# Altium project Internal_Thermostat_STM8_v1.0.PrjPcb
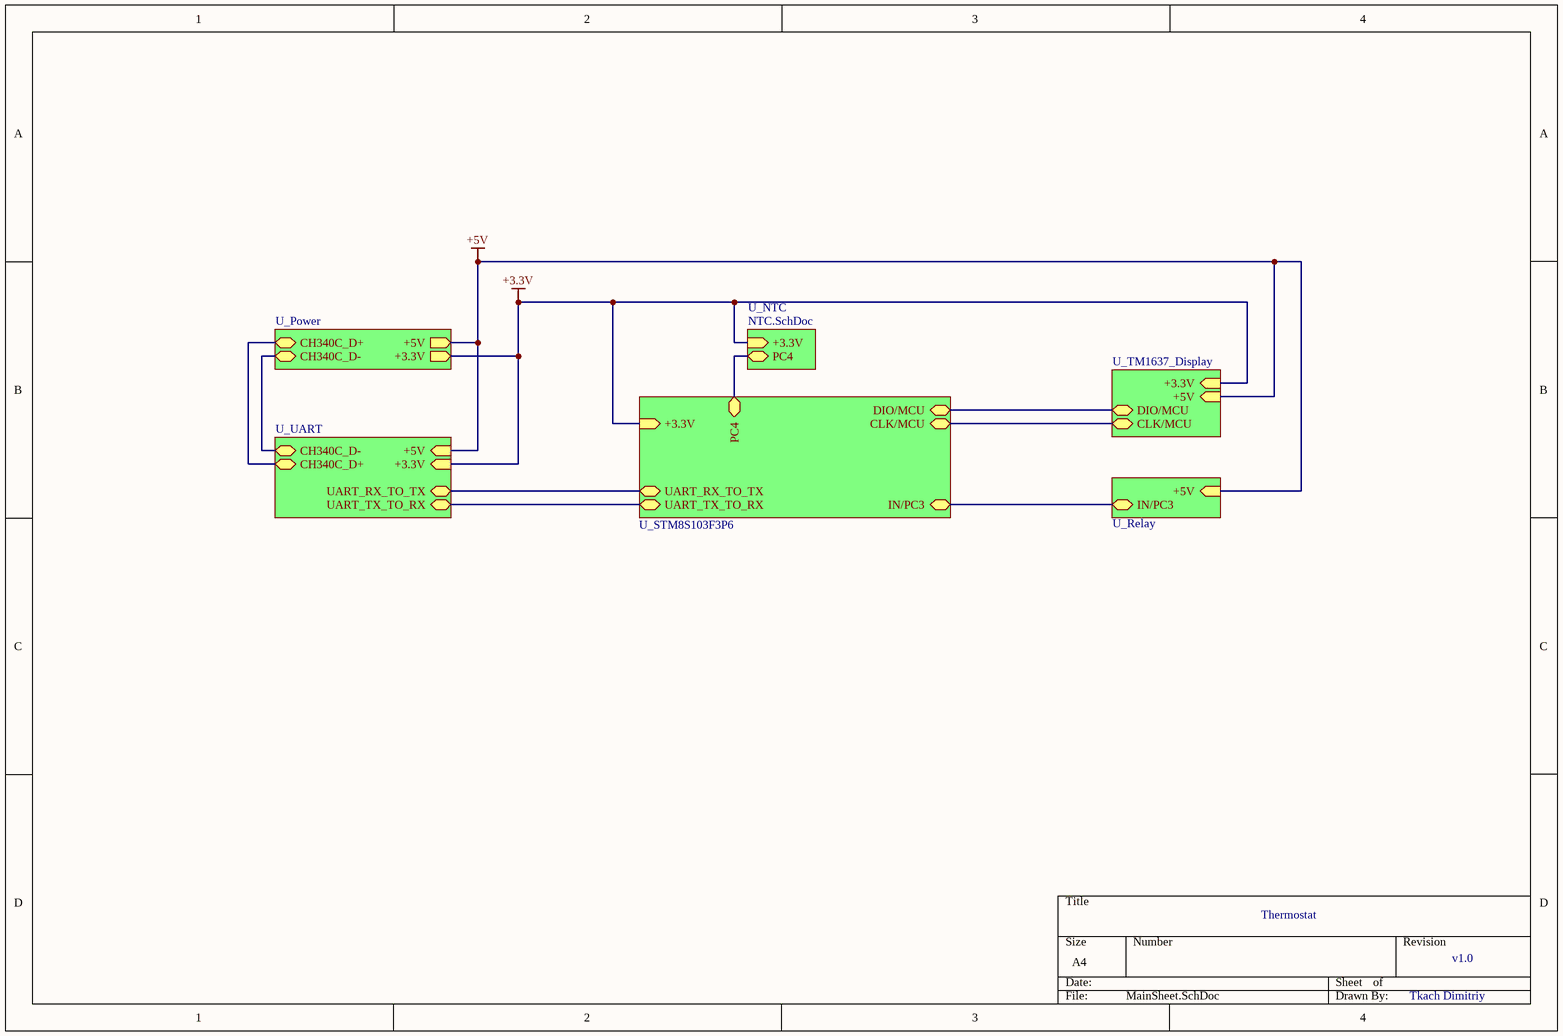
[diagram p0: MainSheet.SchDoc]
Copper_Weight: 35um; Layer_Count: 2; PCB_Material: FR-4; PCB_Name: Thermostat STM8 v1.0; PCB_Thickness: 1.6mm; SolderMask_Color: Green; Surface_Finish: HASL
7 sheets, 60 parts. Net scope: hierarchical (ports join the sheet entries above them; power ports are global).
Board file: Internal_PCB_Thermostat_STM8_v1.0.PcbDoc
Sheets:
  MainSheet.SchDoc
    U_Power = Power.SchDoc
    U_Relay = Relay.SchDoc
    U_TM1637_Display = TM1637_Display.SchDoc
    U_UART = UART.SchDoc
    U_STM8S103F3P6 = STM8S103F3P6.SchDoc
    U_NTC = NTC.SchDoc

## Sheet MainSheet.SchDoc
size A4; SheetNumber: 1; SheetTotal: 7

### Sub-sheets
U_NTC = NTC.SchDoc: PC4 (bidir), +3.3V (in)
U_Power = Power.SchDoc: CH340C_D+ (bidir), CH340C_D- (bidir), +5V (out), +3.3V (out)
U_Relay = Relay.SchDoc: IN/PC3 (bidir), +5V (in)
U_STM8S103F3P6 = STM8S103F3P6.SchDoc: +3.3V (in), IN/PC3 (bidir), DIO/MCU (bidir), CLK/MCU (bidir), UART_RX_TO_TX (bidir), UART_TX_TO_RX (bidir), PC4 (bidir)
U_TM1637_Display = TM1637_Display.SchDoc: +5V (in), +3.3V (in), DIO/MCU (bidir), CLK/MCU (bidir)
U_UART = UART.SchDoc: +5V (in), CH340C_D+ (bidir), CH340C_D- (bidir), UART_RX_TO_TX (bidir), +3.3V (in), UART_TX_TO_RX (bidir)

### Nets
+3.3V: sheet U_Power/+3.3V, sheet U_TM1637_Display/+3.3V, sheet U_UART/+3.3V, sheet U_STM8S103F3P6/+3.3V, sheet U_NTC/+3.3V
+5V: sheet U_Power/+5V, sheet U_Relay/+5V, sheet U_TM1637_Display/+5V, sheet U_UART/+5V
NetC10_2: sheet U_STM8S103F3P6/PC4, sheet U_NTC/PC4
NetQ1_2: sheet U_TM1637_Display/DIO/MCU, sheet U_STM8S103F3P6/DIO/MCU
NetQ2_2: sheet U_TM1637_Display/CLK/MCU, sheet U_STM8S103F3P6/CLK/MCU
NetQ3_2: sheet U_UART/UART_RX_TO_TX, sheet U_STM8S103F3P6/UART_RX_TO_TX
NetQ5_2: sheet U_UART/UART_TX_TO_RX, sheet U_STM8S103F3P6/UART_TX_TO_RX
NetR4_2: sheet U_Power/CH340C_D+, sheet U_UART/CH340C_D+
NetR9_2: sheet U_Power/CH340C_D-, sheet U_UART/CH340C_D-
NetR17_2: sheet U_Relay/IN/PC3, sheet U_STM8S103F3P6/IN/PC3

### Notes on the sheet
- Thermostat
- v1.0
- Tkach Dimitriy

## Sheet Power.SchDoc
size A4; SheetNumber: 5; SheetTotal: 7
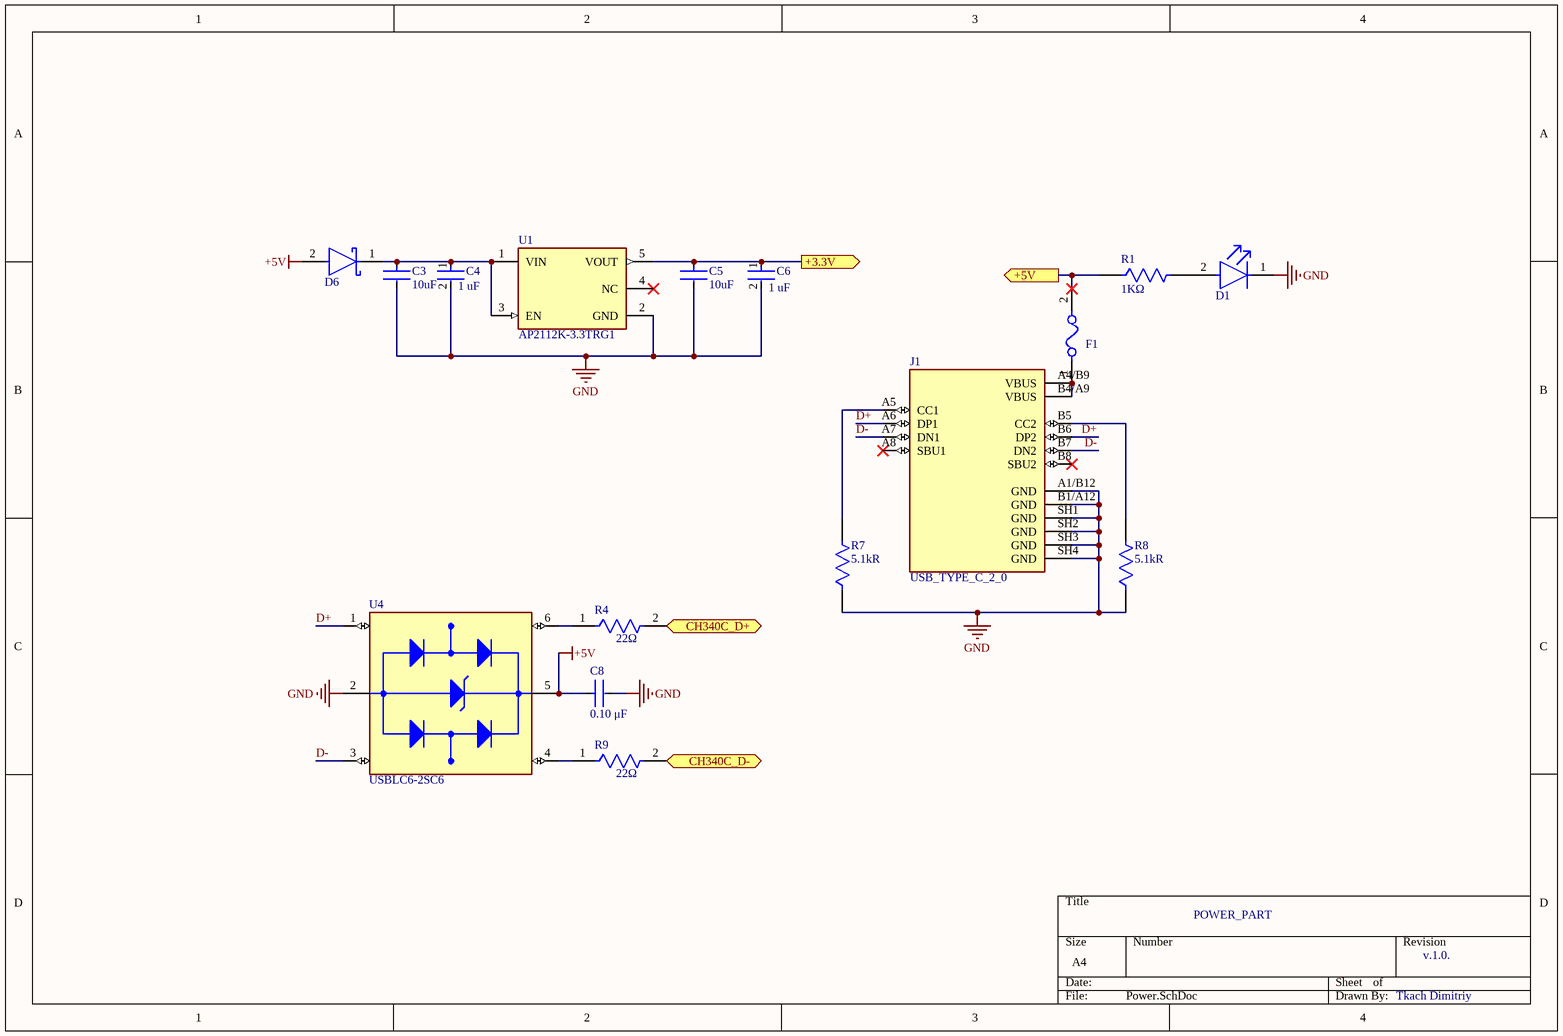
[diagram p1: Power.SchDoc]

### Parts
C3  Capacity: 10uF  [CAPC3216X18M]  (hidden comment: CGA5L1X7R1C106KT0Y0N)
C4  value 1 uF  [CAPC3216X18M]  (hidden comment: CC1206KFX7R7BB105)
C5  Capacity: 10uF  [CAPC3216X18M]  (hidden comment: CGA5L1X7R1C106KT0Y0N)
C6  value 1 uF  [CAPC3216X18M]  (hidden comment: CC1206KFX7R7BB105)
C8  Capacitance: 0.10 μF  [CAPC3216X18M]  (hidden comment: C1206C104K5RACAUTO)
D1  LTST-C150KRKT  [FP-LTST-C150KRKT-MFG]  (value not drawn)
D6  1N5819HW-7-F  [FP-SOD123-MFG]  (value not drawn)
F1  MF-NSMF050-2  [RESC3216X06M]  (value not drawn)
J1  USB_TYPE_C_2_0  [USB Type-C 16Pin]
R1  value 1KΩ  [RESC3216X06M]  (hidden comment: CRGCQ1206F1K0)
R4  Resistance: 22Ω  [RESC3216X06M]  (hidden comment: SR0603FR-7T22RL)
R7  Resistance: 5.1kR  [RESC3216X06M]  (hidden comment: ESR18EZPF5101)
R8  Resistance: 5.1kR  [RESC3216X06M]  (hidden comment: ESR18EZPF5101)
R9  Resistance: 22Ω  [RESC3216X06M]  (hidden comment: SR0603FR-7T22RL)
U1  AP2112K-3.3TRG1  [FP-SOT25-IPC_A]
U4  USBLC6-2SC6  [SOT95P280X145-6N]

### Ports
+3.3V (out, see MainSheet[2B], NTC[3B], STM8S103F3P6[3B], TM1637_Display[1B], UART[2B]), +5V (out, see MainSheet[2B], Relay[2B], TM1637_Display[3B], UART[3B]), CH340C_D+ (bidir, see MainSheet[1B], UART[3B]), CH340C_D- (bidir, see MainSheet[1B], UART[3B])

### Nets
+3.3V: C5.1 C6.1 U1.5(VOUT) ; port +3.3V
+5V: C8.1 D6.2(A) F1.2 R1.1 U4.5(VBUS) ; port +5V
GND: C3.2 C4.2 C5.2 C6.2 C8.2 D1.1(C) J1.A1/B12(GND) J1.B1/A12(GND) J1.SH1(GND) J1.SH2(GND) J1.SH3(GND) J1.SH4(GND) R7.1 R8.1 U1.2(GND) U4.2(GND)
D+: J1.A6(DP1) J1.B6(DP2) U4.1(I/O1_IN)
D-: J1.A7(DN1) J1.B7(DN2) U4.3(I/O2_IN)
NetC3_1: C3.1 C4.1 D6.1(C) U1.1(VIN) U1.3(EN)
NetD1_2: D1.2(A) R1.2
NetF1_1: F1.1 J1.A4/B9(VBUS) J1.B4/A9(VBUS)
NetJ1_A5: J1.A5(CC1) R7.2
NetJ1_B5: J1.B5(CC2) R8.2
NetR4_1: R4.1 U4.6(I/O1_OUT)
NetR4_2: R4.2 ; port CH340C_D+
NetR9_1: R9.1 U4.4(I/O2_OUT)
NetR9_2: R9.2 ; port CH340C_D-

Not connected (* = marked no-connect by the designer): J1 A8(SBU1)* B8(SBU2)*; U1 4(NC)*

### Notes on the sheet
- POWER_PART
- v.1.0.
- Tkach Dimitriy

### Library data of the parts
C3 C5 = CMP-08246-001386-1: Cap Ceramic 10uF 16V X7R 10% Pad SMD 1206 +125°C Automotive T/R
C4 C6 = CMP-03422-001151-1: CC1206 1 uF X7R 10.00%16 V; Manufacturer: Yageo; Voltage Rating: 16 V; Automotive Grade: NA; Temperature Coefficient: 15%; Material: Ceramic; Tolerance: 0.1; Category: Cap; Temperature: -55°C to +125°C; Temperature Range Low: -55°C; Capacitance: 1 uF; Package: CC1206-1.25; ComponentLink2Description: Datasheet; RoHS: TRUE; Footprint Url: http://www.yageo.com/exep/pages/download/literatures/UPY-C_GEN_24.pdf; Temperature Characteristic: X7R; ComponentLink2URL: http://www.yageo.com/documents/recent/UPY-NP0X7R_HV_1KV-to-3KV_11.pdf; Height: 1.45mm; Mouser Description: Multilayer Ceramic Capacitors MLCC - SMD/SMT 1.0uF 16V X7R 10%; Lead Free: Yes; Temperature Range High: +125°C; Device Class L1: Passive Components; Octopart: https://octopart.com/cc1206kfx7r7bb105-yageo-22250947; Automotive: No; Device Class L3: Ceramic Capacitors; Device Class L2: Capacitors; Manufacturer Part Number: CC1206KFX7R7BB105
C8 = CMP-03020-005759-1: CAP CER 0.1UF 50V X7R 1206; Manufacturer: KEMET; Temperature Coefficient: 15%; Value: 0.10 μF; Material: Ceramic; Automotive Grade: Grade 0; Tolerance: 0.1; RoHS: TRUE; Lead Free: Yes; ComponentLink2Description: Datasheet; Automotive: Yes; Temperature Characteristic: X7R; Temperature Range Low: -55°C; Voltage Rating: 50 V; Device Class L1: Passive Components; Ipc Land Pattern Name: CAPC320160X78; Mouser Description: Multilayer Ceramic Capacitors MLCC - SMD/SMT 0.1uF 50volts 10% X7R AUTO; Octopart: https://octopart.com/c1206c104k5racauto-kemet-12595586; Device Class L3: Ceramic Capacitors; Manufacturer Part Number: C1206C104K5RACAUTO; Digikey Description: CAP CER 0.1UF 50V X7R 1206; Temperature Range High: +150°C; Temperature: -55°C to +150°C; Device Class L2: Capacitors; ComponentLink2URL: https://content.kemet.com/datasheets/KEM_C1007_X8R_ULTRA_150C_SMD.pdf; Package: C1206C-EB; Category: Cap; Height: 0.88mm
D1 = 8706943c75ba83719d021d2fdc84c58: LED RED CLEAR 1206 SMD; Wavelength: 639nm; Power Dissipation: 62.5mW; Luminous Intensity: 54mcd; Test Current: 20mA; Forward Current: 30mA; Reverse Voltage: 5V; Viewing Angle: 130°; Number of Elements: 1; Lens Style: Diffused; Power Rating: 75mW; Lens Color: Colorless; Forward Voltage: 2V; Dominant Wavelength: 631nm; Depth: 1.6mm; Mount: Surface Mount; Packaging: Tape and Reel; Case Code (Metric): 3216; Lens Transparency: Clear; Illumination Color: Red; Radiation Hardening: No; Min Operating Temperature: -30°C; Height: 1.1mm; Case Code (Imperial): 1206; Number of Pins: 2; Length: 3.2mm; Lead Free: Lead Free; Color: Red; Width: 1.6mm; Number of LEDs: 1; Max Operating Temperature: 85°C; Case/Package: 1206; Package Quantity: 1
D6 = CMP-0303-00003-3: DIODE SCHOTTKY 40V 1A SOD123; Forward Voltage: 450mV; Capacitance: 110pF; Max Forward Surge Current (Ifsm): 25A; Peak Reverse Current: 50uA; Polarity: Standard; Element Configuration: Single; Max Power Dissipation: 450mW; Min Operating Temperature: -65°C; Package Quantity: 3000; Contact Plating: Tin; Weight: 0.000353oz; Max Repetitive Reverse Voltage (Vrrm): 40V; Max Reverse Voltage (DC): 40V; Height: 1.25mm; Average Rectified Current: 1A; Width: 1.7mm; Case/Package: SOD-123-2; Lead Free: Lead Free; Max Operating Temperature: 125°C; Current Rating: 1A; Termination: SMD/SMT; Forward Current: 1A; Radiation Hardening: No; Number of Pins: 2; Length: 2.85mm; Voltage Rating (DC): 40V; REACH SVHC: No SVHC; Peak Non-Repetitive Surge Current: 25A; Packaging: Tape and Reel; Output Current: 1A
F1 = CMP-07400-000036-1: PTC RESET FUSE 13.2V 500MA 1206; Manufacturer: Bourns; Resistance: 0.15-0.7Ω; Hold Current: 0.5A; Trip Current: 1A; Current Rating: 100A; Value: 0.15-0.7Ω; Automotive Grade: Grade 3; Trip Time: 0.1s; Temperature Range Low: -40°C; Temperature: -40°C to +85°C; Digikey Description: PTC RESET FUSE 13.2V 500MA 1206; Ambient Temperature Range Low: -40°C; RoHS: TRUE; Device Class L2: PTC Resettable Fuses; Octopart: https://octopart.com/mf-nsmf050-2-bourns-34532; ComponentLink2Description: Datasheet; Voltage Rating: 13.2V; Category: Fuse; ComponentLink2URL: https://www.bourns.com/docs/product-datasheets/mfnsmf.pdf?sfvrsn=39c76af6_14; Mouser Description: Resettable Fuses - PPTC 0.50A 13.2V 0.15ohm 1206 Footprint; Temperature Range High: +85°C; Device Class L1: Circuit Protection; Device Class L3: unset; Automotive: Yes; Package: MF-NSMF050-2; Ambient Temperature Range High: +85°C; Height: 0.85mm; Manufacturer Part Number: MF-NSMF050-2; Lead Free: Yes
J1 = USB_CMP-002-00072-1: USB-C (USB TYPE-C) USB 2.0 Receptacle Connector 24 (16+8 Dummy) Position Surface Mount, Right Angle; MP: USB4110GFA; MF: Global Connector Technology; Check_prices: https://www.snapeda.com/parts/USB4110GFA/Global+Connector+Technology/view-part/?ref=eda; Design Item ID: USB4110GFA; Source: USB4110GFA.SchLib; Pins: 16; Component Type: Connectors; SnapEDA_Link: https://www.snapeda.com/parts/USB4110GFA/Global+Connector+Technology/view-part/?ref=snap; Value: *; Case/Package: None
R1 = CMP-03211-006592-1: CRGCQ1206 1KΩ 0.25W 1% ±100ppm/°C 200V; Manufacturer: TE Connectivity; Automotive Grade: Grade 685; Tolerance: 0.01; Ipc Land Pattern Name: RESC310155X55; Temperature Range Low: -55°C; Device Class L3: Chip SMD Resistors; ComponentLink2URL: https://www.te.com/commerce/DocumentDelivery/DDEController?Action=showdoc&DocId=Data+Sheet%7F1773204-3%7F1%7Fpdf%7FEnglish%7FENG_DS_1773204-3_1.pdf%7F4-2176347-694; Automotive: Yes; Temperature: -55°C to +155°C; Manufacturer Part Number: CRGCQ1206F1K0; Package: CRGCQ1206; Octopart: https://octopart.com/crgcq1206f1k0-te+connectivity-91018258; Device Class L1: Passive Components; Series: CRGCQ; Device Class L2: Resistors; RoHS: TRUE; Lead Free: Yes; ComponentLink2Description: Datasheet; Power Rating: 0.25W; Temperature Coefficient: ±100ppm/°C; Voltage Rating: 200V; Temperature Range High: +155°C; Height: 0.65mm; Category: Res; Resistance: 1KΩ; Composition: Thick Film; Ambient Temperature Range High: +70°C
R4 R9 = CMP-03412-021889-1: RES 22 OHM 1% 1/4W 0603; Manufacturer: Yageo; Power Rating: 0.25W; Automotive Grade: Grade 0; Tolerance: 0.01; Voltage Rating: 75V; Value: 22Ω; Automotive: Yes; Manufacturer Part Number: SR0603FR-7T22RL; Device Class L1: Passive Components; Temperature Range Low: -55°C; Package: SR0603; Device Class L3: Chip SMD Resistors; Digikey Description: RES 22 OHM 1% 1/4W 0603; RoHS: TRUE; Device Class L2: Resistors; Height: 0.55mm; Ipc Land Pattern Name: RESC16080X45; Temperature Range High: +155°C; Temperature: -55°C to +155°C; Octopart: https://octopart.com/sr0603fr-7t22rl-yageo-91478080; Composition: Thick Film; Category: Res; ComponentLink2URL: http://www.yageo.com/documents/recent/PYu-SR_D_F%20tol_RoHS_L_3.pdf; Lead Free: Yes; Footprint Url: http://www.yageo.com/exep/pages/download/literatures/PYu-R_Mount_10.pdf; ComponentLink2Description: Datasheet; Series: SR
R7 R8 = CMP-08839-028234-1: 5.1kΩ ±1% 0.5W 1206 Anti-Surge Chip Resistor AEC-Q200; Temperature Coefficient: 100ppm/°C; Max Power Dissipation: 333mW; Resistor Type: Thick Film; Max Operating Temperature: 155°C; Min Operating Temperature: -55°C; Features: Automotive AEC-Q200; Height: 0.026inch; Length: 0.126inch; Packaging: Tape and Reel; Width: 0.063inch; Case/Package: 1206; Tolerance: 1%; Series: ESR18; Number of Terminations: 2; RoHS Compliant: Yes; Package Quantity: 5000
U1 = CMP-12756-000035-1: IC REG LINEAR 3.3V 600MA SOT25; Number of Regulators: 1; Output Type: Fixed; Polarity: Positive; Min Input Voltage: 2.5V; Max Input Voltage: 6V; Accuracy: 1.5%; Quiescent Current: 55uA; Dropout Voltage: 250mV; Min Operating Temperature: -40°C; Length: 3.1mm; Output Current: 600mA; Max Operating Temperature: 85°C; Package Quantity: 1; Output Voltage: 3.3V; Width: 1.7mm; Number of Outputs: 1; Packaging: Tape and Reel; Height: 1.3mm; Lead Free: Lead Free; Max Output Current: 600mA; Case/Package: SOT-23-5; Mount: Surface Mount; Number of Pins: 5
U4 = USBLC6-2SC6: 17V Clamp 5A (8/20Âµs) Ipp Tvs Diode Surface Mount SOT-23-6; MF: STMicroelectronics; Value: *; SnapEDA_Link: https://www.snapeda.com/parts/USBLC6-2SC6/STMicroelectronics/view-part/?ref=snap; Check_prices: https://www.snapeda.com/parts/USBLC6-2SC6/STMicroelectronics/view-part/?ref=eda; Purchase-URL: https://pricing.snapeda.com/search/part/USBLC6-2SC6/?ref=eda; Price: None; Availability: In Stock; Package: SOT-23-6 STMicroelectronics; MP: USBLC6-2SC6

## Sheet Relay.SchDoc
size A4; SheetNumber: 4; SheetTotal: 7
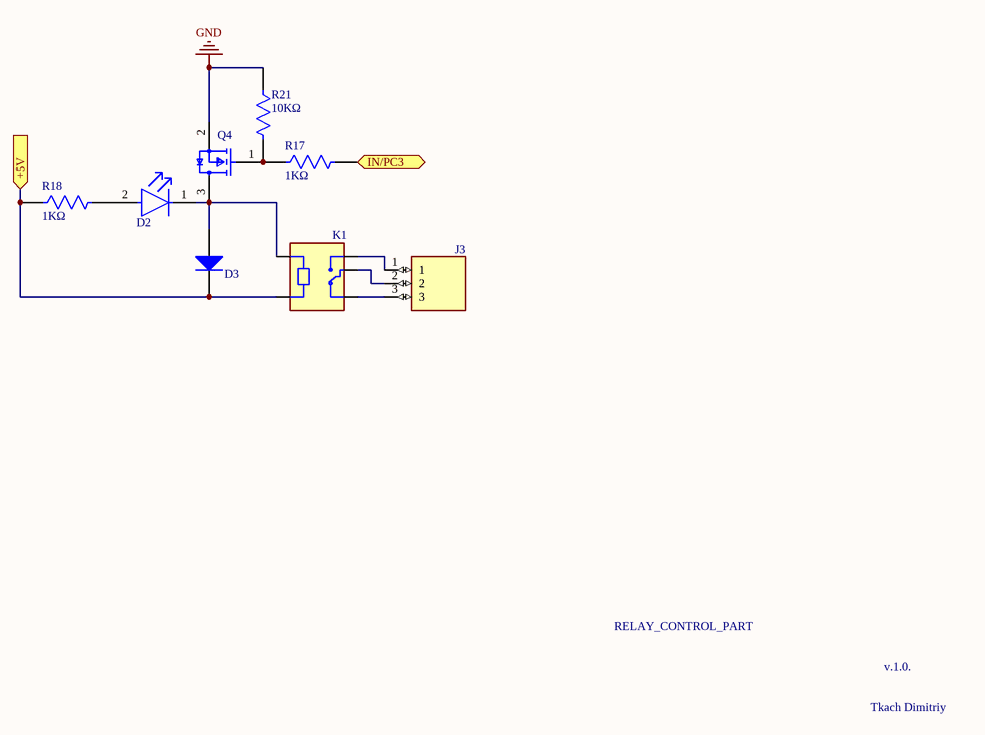
[diagram p2: Relay.SchDoc]

### Parts
D2  LTST-C150KRKT  [FP-LTST-C150KRKT-MFG]  (value not drawn)
D3  1N4148W-7-F  [DIOD-SOD123-2_V]  (value not drawn)
J3  39543-0603  [39543-0603]  (value not drawn)
K1  SRD-05VDC-SL-C  [RELAY_SRD-05VDC-SL-C]  (value not drawn)
Q4  2N7002-7-F  [FP-SOT23-MFG]  (value not drawn)
R17  value 1KΩ  [RESC3216X06M]  (hidden comment: CRGCQ1206F1K0)
R18  value 1KΩ  [RESC3216X06M]  (hidden comment: CRGCQ1206F1K0)
R21  Resistance: 10KΩ  [RESC3216X06M]  (hidden comment: CRGP1206F10K)

### Ports
+5V (in, see MainSheet[4B], Power[3B], TM1637_Display[3B], UART[3B]), IN/PC3 (bidir, see MainSheet[3B], STM8S103F3P6[2B])

### Nets
+5V: D3.2(K) K1.A2 R18.1 ; port +5V
GND: Q4.2(S) R21.1
NetD2_1: D2.1(C) D3.1(A) K1.A1 Q4.3(D)
NetD2_2: D2.2(A) R18.2
NetJ3_1: J3.1 K1.NO
NetJ3_2: J3.2 K1.COM
NetJ3_3: J3.3 K1.NC
NetQ4_1: Q4.1(G) R17.1 R21.2
NetR17_2: R17.2 ; port IN/PC3

### Notes on the sheet
- RELAY_CONTROL_PART
- v.1.0.
- Tkach Dimitriy

### Library data of the parts
D2 = 8706943c75ba83719d021d2fdc84c58: as D1 on sheet Power; Depth: 1.6mm; Mount: Surface Mount; Packaging: Tape and Reel; Case Code (Metric): 3216; Lens Transparency: Clear; Illumination Color: Red; Radiation Hardening: No; Min Operating Temperature: -30°C; Height: 1.1mm; Case Code (Imperial): 1206; Number of Pins: 2; Length: 3.2mm; Lead Free: Lead Free; Color: Red; Width: 1.6mm; Number of LEDs: 1; Max Operating Temperature: 85°C; Case/Package: 1206; Package Quantity: 1
D3 = CMP-2000-04932-2: Fast Switching Diode, 100 V, 0.15 A, -65 to 150 degC, 2-Pin?SOD123, RoHS, Tape and Reel; Recovery Time: 4ns; Brand: DiodesIncorporated; Unit Weight: 0.000353oz; Max Surge Current: 2A; Peak Reverse Voltage: 100V; Ir - Reverse Current: 1uA; Vf - Forward Voltage: 1.25V; Configuration: Single; If - Forward Current: 0.15A; Product Category: Diodes-GeneralPurpose,Power,Switching; Operating Temperature Range: -65Cto+150C; Packaging: Reel; Manufacturer URL: http://www.diodes.com/; Maximum Operating Temperature: +150C; Height: 1.25mm; Minimum Operating Temperature: -65C; Product: SwitchingDiodes; Package URL: http://www.diodes.com/datasheets/ds18004.pdf; Type: SwitchingDiode; Package Reference: SOD123-2; Width: 1.7mm; Datasheet URL: http://www.farnell.com/datasheets/1915529.pdf; Datasheet Version: Rev. 24-2, 10/2013; Series: 1N4148; Factory Pack Quantity: 3000; Length: 2.85mm; RoHS: True; Manufacturer: DiodesIncorporated; Mounting Style: SMD/SMT; Package / Case: SOD-123
J3 = CMP-037-000000-1: 3 Position Wire to Board Terminal Block Horizontal with Board 0.197 (5.00mm) Through Hole; MF: Molex; MP: 395430603; Component Type: Mechanicals; SnapEDA_Link: https://www.snapeda.com/parts/395430603/Molex/view-part/?ref=snap; Package: None; Check_prices: https://www.snapeda.com/parts/395430603/Molex/view-part/?ref=eda; Value: *; Source: 39543-0603.SchLib; Design Item ID: 39543-0603; Pin Count: 3
K1 = CMP-013-000000-1: 5V Trigger Relay Module For Arduino And Raspberry Pi 5V Trigger Relay Module For Arduino And Raspberry Pi; MF: Songle Relay; Source: SRD-05VDC-SL-C.SchLib; Check_prices: https://www.snapeda.com/parts/SRD-05VDC-SL-C/Songle+Relay/view-part/?ref=eda; Component Type: Standard; MP: SRD-05VDC-SL-C; SnapEDA_Link: https://www.snapeda.com/parts/SRD-05VDC-SL-C/Songle+Relay/view-part/?ref=snap; Price: None; Package: NON STANDARD-5 Songle Relay; Availability: Not in stock; Design Item ID: SRD-05VDC-SL-C; Value: *; Pin Count: 5
Q4 = 3b9c635fedb024a5347a57b145af9cc: MOSFET N-CH 60V 115MA SOT23-3; Turn-On Delay Time: 7ns; Turn-Off Delay Time: 11ns; Drain to Source Resistance: 7.5R; Rise Time: 3ns; Drain to Source Breakdown Voltage: 70V; Input Capacitance: 50pF; Number of Elements: 1; Power Dissipation: 540mW; Max Power Dissipation: 300mW; Fall Time: 5.6ns; Gate to Source Voltage (Vgs): 20V; Threshold Voltage: 2.5V; Element Configuration: Single; Termination: SMD/SMT; Weight: 0.000282oz; Radiation Hardening: No; Max Operating Temperature: 150°C; On-State Resistance: 7.5R; Mount: Surface Mount; Current Rating: 115mA; Contact Plating: Tin; Lead Free: Lead Free; Min Operating Temperature: -55°C; Number of Pins: 3; REACH SVHC: No SVHC; Drain to Source Voltage (Vdss): 60V; Width: 1.3mm; Package Quantity: 3000; Length: 2.9mm; Case/Package: SOT-23; Number of Channels: 1; Dual Supply Voltage: 60V; Packaging: Tape and Reel; Height: 1mm; Voltage Rating (DC): 60V; Nominal Vgs: 2.5V; Continuous Drain Current (ID): 115mA; Voltage: 60V; Rds On Max: 7.5R
R17 R18 = CMP-03211-006592-1: as R1 on sheet Power; Ipc Land Pattern Name: RESC310155X55; Temperature Range Low: -55°C; Device Class L3: Chip SMD Resistors; ComponentLink2URL: https://www.te.com/commerce/DocumentDelivery/DDEController?Action=showdoc&DocId=Data+Sheet%7F1773204-3%7F1%7Fpdf%7FEnglish%7FENG_DS_1773204-3_1.pdf%7F4-2176347-694; Automotive: Yes; Temperature: -55°C to +155°C; Manufacturer Part Number: CRGCQ1206F1K0; Package: CRGCQ1206; Octopart: https://octopart.com/crgcq1206f1k0-te+connectivity-91018258; Device Class L1: Passive Components; Series: CRGCQ; Device Class L2: Resistors; RoHS: TRUE; Lead Free: Yes; ComponentLink2Description: Datasheet; Power Rating: 0.25W; Temperature Coefficient: ±100ppm/°C; Voltage Rating: 200V; Temperature Range High: +155°C; Height: 0.65mm; Category: Res; Resistance: 1KΩ; Composition: Thick Film; Ambient Temperature Range High: +70°C
R21 = CMP-03211-004788-1: CRGP 1206 10K 1%; Manufacturer: TE; Temperature Coefficient: ±100ppm/°C; Value: 10KΩ; Tolerance: 0.01; Power Rating: 0.5W; Voltage Rating: 200V; Package: CRGP1206; Ambient Temperature Range High: +70°C; Device Class L2: Resistors; Lead Free: Yes; Automotive: No; Series: CRGP; Temperature Range High: +155°C; Ipc Land Pattern Name: RESC310155X55; Device Class L1: Passive Components; Octopart: https://octopart.com/crgp1206f10k-te+connectivity-91018843; Temperature: -55°C to +155°C; Category: Res; Height: 0.65mm; Temperature Range Low: -55°C; RoHS: TRUE; Manufacturer Part Number: CRGP1206F10K; Digikey Description: CRGP 1206 10K 1%; Device Class L3: Chip SMD Resistors; Composition: Thick Film; ComponentLink2URL: https://www.mouser.com/datasheet/2/418/NG_DS_9-1773463-9_A-1358566.pdf; ComponentLink2Description: Datasheet

## Sheet TM1637_Display.SchDoc
size A4; SheetNumber: 6; SheetTotal: 7
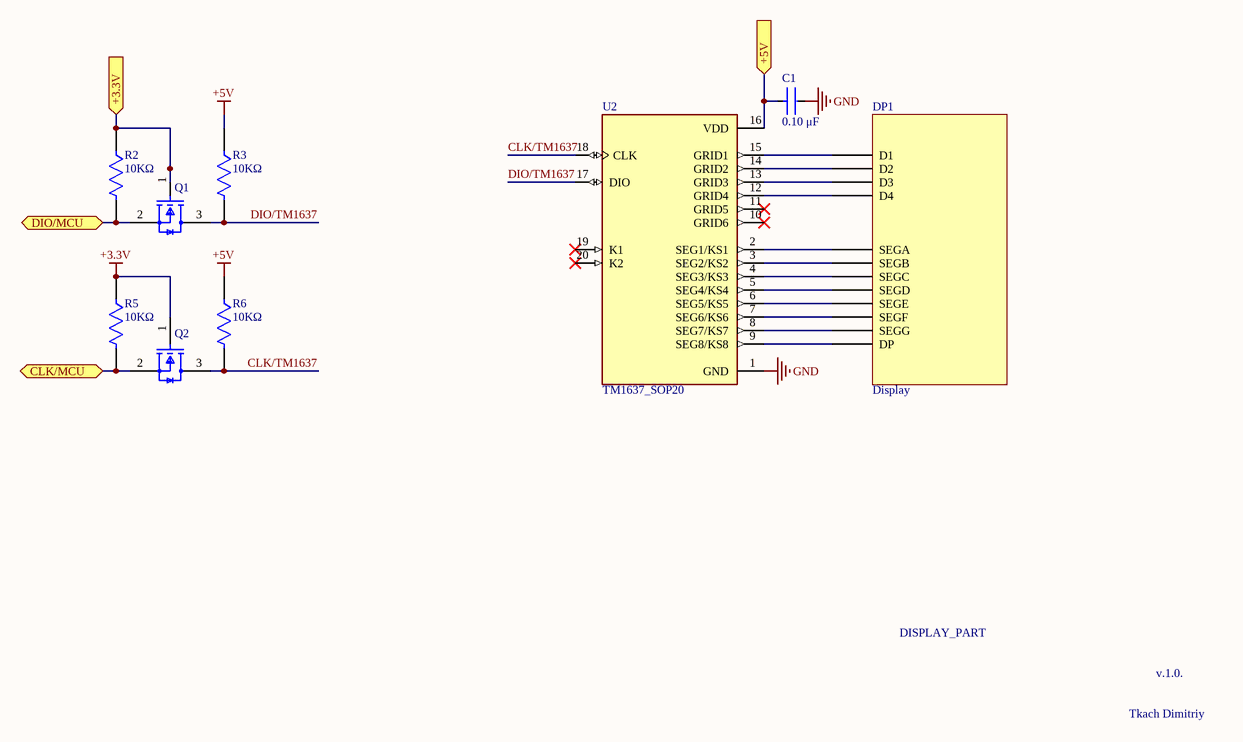
[diagram p3: TM1637_Display.SchDoc]

### Parts
C1  Capacitance: 0.10 μF  [CAPC3216X18M]  (hidden comment: C1206C104K5RACAUTO)
DP1  Display  [3461BS-1]
Q1  2N7002-7-F  [FP-SOT23-MFG]  (value not drawn)
Q2  2N7002-7-F  [FP-SOT23-MFG]  (value not drawn)
R2  Resistance: 10KΩ  [RESC3216X06M]  (hidden comment: CRGP1206F10K)
R3  Resistance: 10KΩ  [RESC3216X06M]  (hidden comment: CRGP1206F10K)
R5  Resistance: 10KΩ  [RESC3216X06M]  (hidden comment: CRGP1206F10K)
R6  Resistance: 10KΩ  [RESC3216X06M]  (hidden comment: CRGP1206F10K)
U2  TM1637_SOP20  [SOIC127P1035X255-20N]

### Ports
+3.3V (in, see MainSheet[4B], NTC[3B], Power[3B], STM8S103F3P6[3B], UART[2B]), +5V (in, see MainSheet[4B], Power[3B], Relay[2B], UART[3B]), CLK/MCU (bidir, see MainSheet[3B], STM8S103F3P6[2B]), DIO/MCU (bidir, see MainSheet[3B], STM8S103F3P6[2B])

### Nets
+3.3V: Q1.1(G) Q2.1(G) R2.1 R5.1 ; port +3.3V
+5V: C1.1 R3.1 R6.1 U2.16(VDD) ; port +5V
GND: C1.2 U2.1(GND)
CLK/TM1637: Q2.3(D) R6.2 U2.18(CLK)
DIO/TM1637: Q1.3(D) R3.2 U2.17(DIO)
NetDP1_D1: DP1.D1 U2.15(GRID1)
NetDP1_D2: DP1.D2 U2.14(GRID2)
NetDP1_D3: DP1.D3 U2.13(GRID3)
NetDP1_D4: DP1.D4 U2.12(GRID4)
NetDP1_DP: DP1.DP U2.9(SEG8/KS8)
NetDP1_SEGA: DP1.SEGA U2.2(SEG1/KS1)
NetDP1_SEGB: DP1.SEGB U2.3(SEG2/KS2)
NetDP1_SEGC: DP1.SEGC U2.4(SEG3/KS3)
NetDP1_SEGD: DP1.SEGD U2.5(SEG4/KS4)
NetDP1_SEGE: DP1.SEGE U2.6(SEG5/KS5)
NetDP1_SEGF: DP1.SEGF U2.7(SEG6/KS6)
NetDP1_SEGG: DP1.SEGG U2.8(SEG7/KS7)
NetQ1_2: Q1.2(S) R2.2 ; port DIO/MCU
NetQ2_2: Q2.2(S) R5.2 ; port CLK/MCU

Not connected (* = marked no-connect by the designer): U2 10(GRID6)* 11(GRID5)* 19(K1)* 20(K2)*

### Notes on the sheet
- DISPLAY_PART
- v.1.0.
- Tkach Dimitriy

### Library data of the parts
C1 = CMP-03020-005759-1: as C8 on sheet Power; RoHS: TRUE; Lead Free: Yes; ComponentLink2Description: Datasheet; Automotive: Yes; Temperature Characteristic: X7R; Temperature Range Low: -55°C; Voltage Rating: 50 V; Device Class L1: Passive Components; Ipc Land Pattern Name: CAPC320160X78; Mouser Description: Multilayer Ceramic Capacitors MLCC - SMD/SMT 0.1uF 50volts 10% X7R AUTO; Octopart: https://octopart.com/c1206c104k5racauto-kemet-12595586; Device Class L3: Ceramic Capacitors; Manufacturer Part Number: C1206C104K5RACAUTO; Digikey Description: CAP CER 0.1UF 50V X7R 1206; Temperature Range High: +150°C; Temperature: -55°C to +150°C; Device Class L2: Capacitors; ComponentLink2URL: https://content.kemet.com/datasheets/KEM_C1007_X8R_ULTRA_150C_SMD.pdf; Package: C1206C-EB; Category: Cap; Height: 0.88mm
DP1 = Component_1_1
Q1 Q2 = 3b9c635fedb024a5347a57b145af9cc: as Q4 on sheet Relay; Termination: SMD/SMT; Weight: 0.000282oz; Radiation Hardening: No; Max Operating Temperature: 150°C; On-State Resistance: 7.5R; Mount: Surface Mount; Current Rating: 115mA; Contact Plating: Tin; Lead Free: Lead Free; Min Operating Temperature: -55°C; Number of Pins: 3; REACH SVHC: No SVHC; Drain to Source Voltage (Vdss): 60V; Width: 1.3mm; Package Quantity: 3000; Length: 2.9mm; Case/Package: SOT-23; Number of Channels: 1; Dual Supply Voltage: 60V; Packaging: Tape and Reel; Height: 1mm; Voltage Rating (DC): 60V; Nominal Vgs: 2.5V; Continuous Drain Current (ID): 115mA; Voltage: 60V; Rds On Max: 7.5R
R2 R3 R5 R6 = CMP-03211-004788-1: as R21 on sheet Relay; Package: CRGP1206; Ambient Temperature Range High: +70°C; Device Class L2: Resistors; Lead Free: Yes; Automotive: No; Series: CRGP; Temperature Range High: +155°C; Ipc Land Pattern Name: RESC310155X55; Device Class L1: Passive Components; Octopart: https://octopart.com/crgp1206f10k-te+connectivity-91018843; Temperature: -55°C to +155°C; Category: Res; Height: 0.65mm; Temperature Range Low: -55°C; RoHS: TRUE; Manufacturer Part Number: CRGP1206F10K; Digikey Description: CRGP 1206 10K 1%; Device Class L3: Chip SMD Resistors; Composition: Thick Film; ComponentLink2URL: https://www.mouser.com/datasheet/2/418/NG_DS_9-1773463-9_A-1358566.pdf; ComponentLink2Description: Datasheet
U2 = TM1637_SOP20: LED Drive Control Special Circuit; MF: Titan Micro Electronics; SnapEDA_Link: https://www.snapeda.com/parts/TM1637_SOP20/Titan+Micro+Electronics/view-part/?ref=snap; Package: Package; Value: *; MP: TM1637_SOP20; Check_prices: https://www.snapeda.com/parts/TM1637_SOP20/Titan+Micro+Electronics/view-part/?ref=eda

## Sheet UART.SchDoc
size A4; SheetNumber: 3; SheetTotal: 7
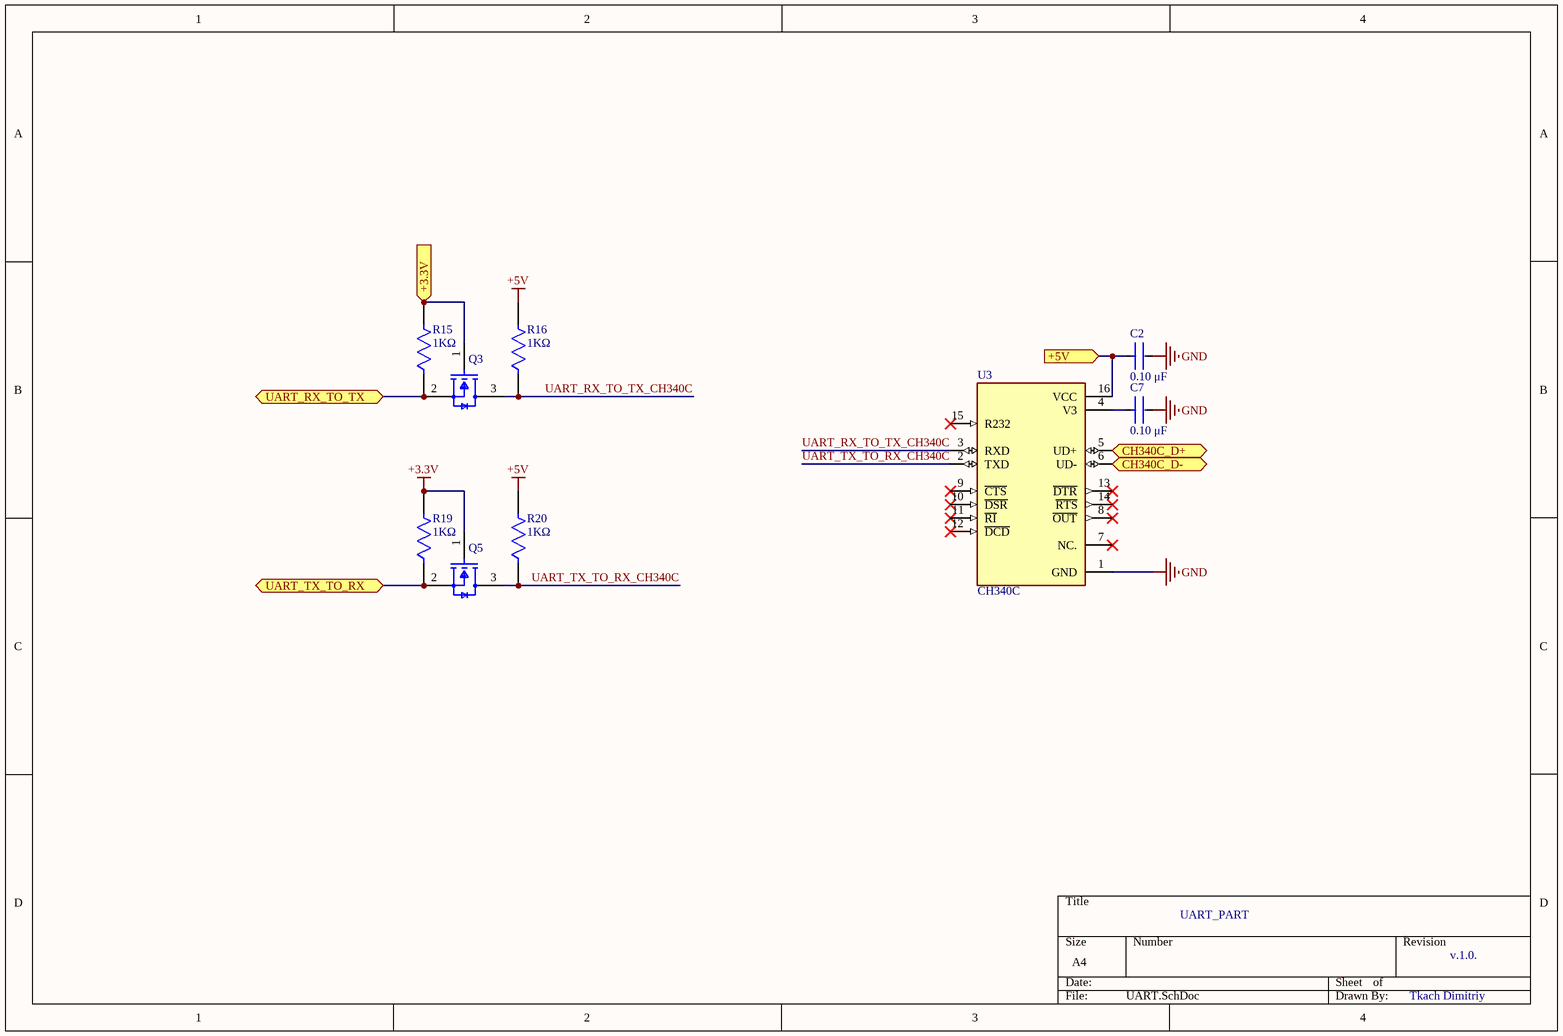
[diagram p4: UART.SchDoc]

### Parts
C2  Capacitance: 0.10 μF  [CAPC3216X18M]  (hidden comment: C1206C104K5RACAUTO)
C7  Capacitance: 0.10 μF  [CAPC3216X18M]  (hidden comment: C1206C104K5RACAUTO)
Q3  2N7002-7-F  [FP-SOT23-MFG]  (value not drawn)
Q5  2N7002-7-F  [FP-SOT23-MFG]  (value not drawn)
R15  value 1KΩ  [RESC3216X06M]  (hidden comment: CRGCQ1206F1K0)
R16  value 1KΩ  [RESC3216X06M]  (hidden comment: CRGCQ1206F1K0)
R19  value 1KΩ  [RESC3216X06M]  (hidden comment: CRGCQ1206F1K0)
R20  value 1KΩ  [RESC3216X06M]  (hidden comment: CRGCQ1206F1K0)
U3  CH340C  [SOIC127P600X180-16N]

### Ports
+3.3V (in, see MainSheet[2B], NTC[3B], Power[3B], STM8S103F3P6[3B], TM1637_Display[1B]), +5V (in, see MainSheet[2B], Power[3B], Relay[2B], TM1637_Display[3B]), CH340C_D+ (bidir, see MainSheet[1B], Power[2C]), CH340C_D- (bidir, see MainSheet[1B], Power[2C]), UART_RX_TO_TX (bidir, see MainSheet[2B], STM8S103F3P6[2C]), UART_TX_TO_RX (bidir, see MainSheet[2B], STM8S103F3P6[2C])

### Nets
+3.3V: Q3.1(G) Q5.1(G) R15.2 R19.2 ; port +3.3V
+5V: C2.1 R16.2 R20.2 U3.16(VCC) ; port +5V
GND: C2.2 C7.2 U3.1(GND)
UART_RX_TO_TX_CH340C: Q3.3(D) R16.1 U3.3(RXD)
UART_TX_TO_RX_CH340C: Q5.3(D) R20.1 U3.2(TXD)
NetC7_1: C7.1 U3.4(V3)
NetQ3_2: Q3.2(S) R15.1 ; port UART_RX_TO_TX
NetQ5_2: Q5.2(S) R19.1 ; port UART_TX_TO_RX
NetR4_2: U3.5(UD+) ; port CH340C_D+
NetR9_2: U3.6(UD-) ; port CH340C_D-

Not connected (* = marked no-connect by the designer): U3 7(NC.)* 8(~{OUT})* 9(~{CTS})* 10(~{DSR})* 11(~{RI})* 12(~{DCD})* 13(~{DTR})* 14(~{RTS})* 15(R232)*

### Notes on the sheet
- UART_PART
- v.1.0.
- Tkach Dimitriy

### Library data of the parts
C2 C7 = CMP-03020-005759-1: as C8 on sheet Power; RoHS: TRUE; Lead Free: Yes; ComponentLink2Description: Datasheet; Automotive: Yes; Temperature Characteristic: X7R; Temperature Range Low: -55°C; Voltage Rating: 50 V; Device Class L1: Passive Components; Ipc Land Pattern Name: CAPC320160X78; Mouser Description: Multilayer Ceramic Capacitors MLCC - SMD/SMT 0.1uF 50volts 10% X7R AUTO; Octopart: https://octopart.com/c1206c104k5racauto-kemet-12595586; Device Class L3: Ceramic Capacitors; Manufacturer Part Number: C1206C104K5RACAUTO; Digikey Description: CAP CER 0.1UF 50V X7R 1206; Temperature Range High: +150°C; Temperature: -55°C to +150°C; Device Class L2: Capacitors; ComponentLink2URL: https://content.kemet.com/datasheets/KEM_C1007_X8R_ULTRA_150C_SMD.pdf; Package: C1206C-EB; Category: Cap; Height: 0.88mm
Q3 Q5 = 3b9c635fedb024a5347a57b145af9cc: as Q4 on sheet Relay; Termination: SMD/SMT; Weight: 0.000282oz; Radiation Hardening: No; Max Operating Temperature: 150°C; On-State Resistance: 7.5R; Mount: Surface Mount; Current Rating: 115mA; Contact Plating: Tin; Lead Free: Lead Free; Min Operating Temperature: -55°C; Number of Pins: 3; REACH SVHC: No SVHC; Drain to Source Voltage (Vdss): 60V; Width: 1.3mm; Package Quantity: 3000; Length: 2.9mm; Case/Package: SOT-23; Number of Channels: 1; Dual Supply Voltage: 60V; Packaging: Tape and Reel; Height: 1mm; Voltage Rating (DC): 60V; Nominal Vgs: 2.5V; Continuous Drain Current (ID): 115mA; Voltage: 60V; Rds On Max: 7.5R
R15 R16 R19 R20 = CMP-03211-006592-1: as R1 on sheet Power; Ipc Land Pattern Name: RESC310155X55; Temperature Range Low: -55°C; Device Class L3: Chip SMD Resistors; ComponentLink2URL: https://www.te.com/commerce/DocumentDelivery/DDEController?Action=showdoc&DocId=Data+Sheet%7F1773204-3%7F1%7Fpdf%7FEnglish%7FENG_DS_1773204-3_1.pdf%7F4-2176347-694; Automotive: Yes; Temperature: -55°C to +155°C; Manufacturer Part Number: CRGCQ1206F1K0; Package: CRGCQ1206; Octopart: https://octopart.com/crgcq1206f1k0-te+connectivity-91018258; Device Class L1: Passive Components; Series: CRGCQ; Device Class L2: Resistors; RoHS: TRUE; Lead Free: Yes; ComponentLink2Description: Datasheet; Power Rating: 0.25W; Temperature Coefficient: ±100ppm/°C; Voltage Rating: 200V; Temperature Range High: +155°C; Height: 0.65mm; Category: Res; Resistance: 1KΩ; Composition: Thick Film; Ambient Temperature Range High: +70°C
U3 = CMP-019-000000-1: USB to serial chip CH340; MF: WCH; Component Type: Standard; Design Item ID: CH340C; Availability: Not in stock; MP: CH340C; Value: *; Source: CH340C.SchLib; SnapEDA_Link: https://www.snapeda.com/parts/CH340C/WCH/view-part/?ref=snap; Package: None; Pin Count: 16; Check_prices: https://www.snapeda.com/parts/CH340C/WCH/view-part/?ref=eda; Price: None

## Sheet STM8S103F3P6.SchDoc
size A4; SheetNumber: 2; SheetTotal: 7
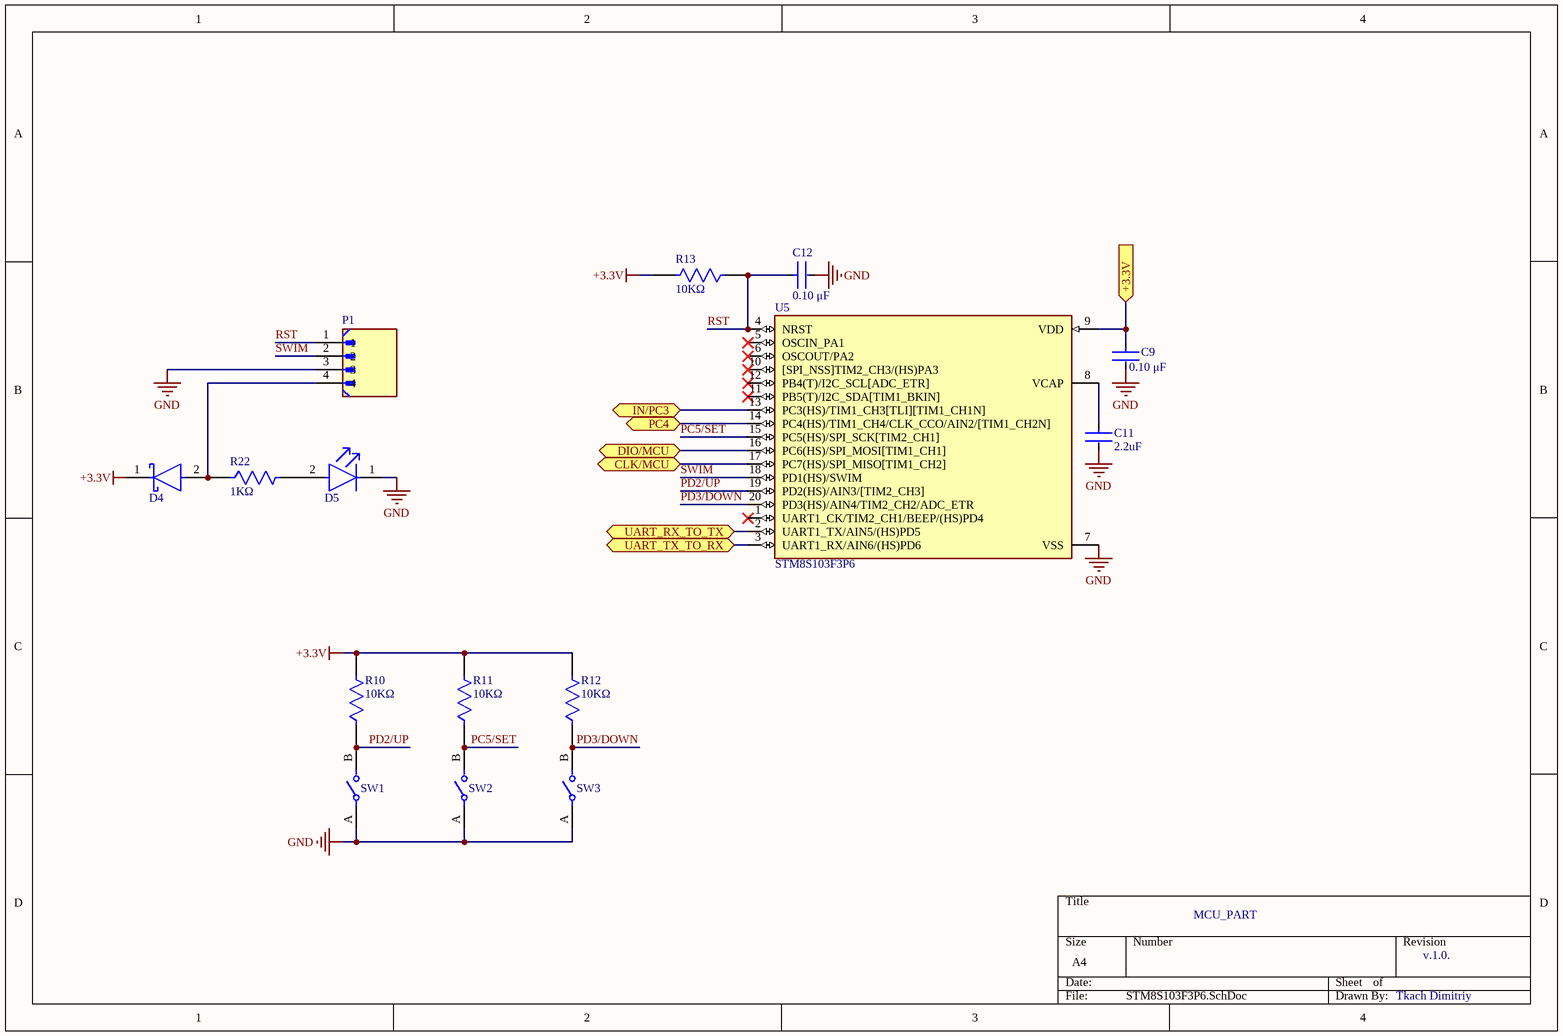
[diagram p5: STM8S103F3P6.SchDoc]

### Parts
C9  Capacitance: 0.10 μF  [CAPC3216X18M]  (hidden comment: C1206C104K5RACAUTO)
C11  Capacitance: 2.2uF  [CAPC3216X18M]  (hidden comment: C1206C225K5RACAUTO)
C12  Capacitance: 0.10 μF  [CAPC3216X18M]  (hidden comment: C1206C104K5RACAUTO)
D4  1N5819HW-7-F  [FP-SOD123-MFG]  (value not drawn)
D5  LTST-C150KRKT  [FP-LTST-C150KRKT-MFG]  (value not drawn)
P1  61300411121  [WURTH_61300411121]  (value not drawn)
R10  Resistance: 10KΩ  [RESC3216X06M]  (hidden comment: CRGP1206F10K)
R11  Resistance: 10KΩ  [RESC3216X06M]  (hidden comment: CRGP1206F10K)
R12  Resistance: 10KΩ  [RESC3216X06M]  (hidden comment: CRGP1206F10K)
R13  Resistance: 10KΩ  [RESC3216X06M]  (hidden comment: CRGP1206F10K)
R22  value 1KΩ  [RESC3216X06M]  (hidden comment: CRGCQ1206F1K0)
SW1  EVQ-QJJ05Q  [FP-EVQ-QJJ05Q-MFG]  (value not drawn)
SW2  EVQ-QJJ05Q  [FP-EVQ-QJJ05Q-MFG]  (value not drawn)
SW3  EVQ-QJJ05Q  [FP-EVQ-QJJ05Q-MFG]  (value not drawn)
U5  STM8S103F3P6  [SOP65P640X120-20N]

### Ports
+3.3V (in, see MainSheet[2B], NTC[3B], Power[3B], TM1637_Display[1B], UART[2B]), CLK/MCU (bidir, see MainSheet[3B], TM1637_Display[1C]), DIO/MCU (bidir, see MainSheet[3B], TM1637_Display[1B]), IN/PC3 (bidir, see MainSheet[3B], Relay[3B]), PC4 (bidir, see MainSheet[2B], NTC[3B]), UART_RX_TO_TX (bidir, see MainSheet[2B], UART[1B]), UART_TX_TO_RX (bidir, see MainSheet[2B], UART[1C])

### Nets
+3.3V: C9.1 D4.1(C) R10.2 R11.2 R12.2 R13.2 U5.9(VDD) ; port +3.3V
GND: C9.2 C11.2 C12.2 D5.1(C) P1.3 SW1.A SW2.A SW3.A U5.7(VSS)
PC5/SET: R11.1 SW2.B U5.15(PC5(HS)/SPI_SCK[TIM2_CH1])
PD2/UP: R10.1 SW1.B U5.19(PD2(HS)/AIN3/[TIM2_CH3])
PD3/DOWN: R12.1 SW3.B U5.20(PD3(HS)/AIN4/TIM2_CH2/ADC_ETR)
RST: C12.1 P1.1 R13.1 U5.4(NRST)
SWIM: P1.2 U5.18(PD1(HS)/SWIM)
NetC10_2: U5.14(PC4(HS)/TIM1_CH4/CLK_CCO/AIN2/[TIM1_CH2N]) ; port PC4
NetC11_1: C11.1 U5.8(VCAP)
NetD4_2: D4.2(A) P1.4 R22.1
NetD5_2: D5.2(A) R22.2
NetQ1_2: U5.16(PC6(HS)/SPI_MOSI[TIM1_CH1]) ; port DIO/MCU
NetQ2_2: U5.17(PC7(HS)/SPI_MISO[TIM1_CH2]) ; port CLK/MCU
NetQ3_2: U5.2(UART1_TX/AIN5/(HS)PD5) ; port UART_RX_TO_TX
NetQ5_2: U5.3(UART1_RX/AIN6/(HS)PD6) ; port UART_TX_TO_RX
NetR17_2: U5.13(PC3(HS)/TIM1_CH3[TLI][TIM1_CH1N]) ; port IN/PC3

Not connected (* = marked no-connect by the designer): U5 1(UART1_CK/TIM2_CH1/BEEP/(HS)PD4)* 5(OSCIN_PA1)* 6(OSCOUT/PA2)* 10([SPI_NSS]TIM2_CH3/(HS)PA3)* 11(PB5(T)/I2C_SDA[TIM1_BKIN])* 12(PB4(T)/I2C_SCL[ADC_ETR])*

### Notes on the sheet
- MCU_PART
- v.1.0.
- Tkach Dimitriy

### Library data of the parts
C9 C12 = CMP-03020-005759-1: as C8 on sheet Power; RoHS: TRUE; Lead Free: Yes; ComponentLink2Description: Datasheet; Automotive: Yes; Temperature Characteristic: X7R; Temperature Range Low: -55°C; Voltage Rating: 50 V; Device Class L1: Passive Components; Ipc Land Pattern Name: CAPC320160X78; Mouser Description: Multilayer Ceramic Capacitors MLCC - SMD/SMT 0.1uF 50volts 10% X7R AUTO; Octopart: https://octopart.com/c1206c104k5racauto-kemet-12595586; Device Class L3: Ceramic Capacitors; Manufacturer Part Number: C1206C104K5RACAUTO; Digikey Description: CAP CER 0.1UF 50V X7R 1206; Temperature Range High: +150°C; Temperature: -55°C to +150°C; Device Class L2: Capacitors; ComponentLink2URL: https://content.kemet.com/datasheets/KEM_C1007_X8R_ULTRA_150C_SMD.pdf; Package: C1206C-EB; Category: Cap; Height: 0.88mm
C11 = CMP-03020-034660-1: CAP CER 2.2UF 50V X7R 1206; Tolerance: 10%; Dielectric Material: Ceramic; Case Code (Metric): 3216; Voltage Rating (DC): 50V; Max Operating Temperature: 125°C; Voltage Rating: 50V; Construction: Flat; Package Quantity: 1; Width: 0.063inch; Radiation Hardening: No; Packaging: Tape and Reel; Ratings: AEC-Q200; Contact Plating: Tin; Dielectric: X7R; RoHS Compliant: Yes; Length: 3.2mm; Thickness: 0.071inch; Case/Package: 1206; Series: C; Depth: 1.6mm; REACH SVHC: No SVHC; Mount: Surface Mount; Height: 1.6mm; Termination: SMD/SMT; Case Code (Imperial): 1206; Min Operating Temperature: -55°C
D4 = CMP-0303-00003-3: as D6 on sheet Power; Min Operating Temperature: -65°C; Package Quantity: 3000; Contact Plating: Tin; Weight: 0.000353oz; Max Repetitive Reverse Voltage (Vrrm): 40V; Max Reverse Voltage (DC): 40V; Height: 1.25mm; Average Rectified Current: 1A; Width: 1.7mm; Case/Package: SOD-123-2; Lead Free: Lead Free; Max Operating Temperature: 125°C; Current Rating: 1A; Termination: SMD/SMT; Forward Current: 1A; Radiation Hardening: No; Number of Pins: 2; Length: 2.85mm; Voltage Rating (DC): 40V; REACH SVHC: No SVHC; Peak Non-Repetitive Surge Current: 25A; Packaging: Tape and Reel; Output Current: 1A
D5 = 8706943c75ba83719d021d2fdc84c58: as D1 on sheet Power; Depth: 1.6mm; Mount: Surface Mount; Packaging: Tape and Reel; Case Code (Metric): 3216; Lens Transparency: Clear; Illumination Color: Red; Radiation Hardening: No; Min Operating Temperature: -30°C; Height: 1.1mm; Case Code (Imperial): 1206; Number of Pins: 2; Length: 3.2mm; Lead Free: Lead Free; Color: Red; Width: 1.6mm; Number of LEDs: 1; Max Operating Temperature: 85°C; Case/Package: 1206; Package Quantity: 1
P1 = 61300411121: Connector Header Through Hole 4 position 0.100 (2.54mm); MF: WÃ¼rth Elektronik; SnapEDA_Link: https://www.snapeda.com/parts/61300411121/W%25C3%25BCrth+Elektronik+Midcom/view-part/?ref=snap; Package: None; Value: *; MP: 61300411121; Check_prices: https://www.snapeda.com/parts/61300411121/W%25C3%25BCrth+Elektronik+Midcom/view-part/?ref=eda
R10-R13 = CMP-03211-004788-1: as R21 on sheet Relay; Package: CRGP1206; Ambient Temperature Range High: +70°C; Device Class L2: Resistors; Lead Free: Yes; Automotive: No; Series: CRGP; Temperature Range High: +155°C; Ipc Land Pattern Name: RESC310155X55; Device Class L1: Passive Components; Octopart: https://octopart.com/crgp1206f10k-te+connectivity-91018843; Temperature: -55°C to +155°C; Category: Res; Height: 0.65mm; Temperature Range Low: -55°C; RoHS: TRUE; Manufacturer Part Number: CRGP1206F10K; Digikey Description: CRGP 1206 10K 1%; Device Class L3: Chip SMD Resistors; Composition: Thick Film; ComponentLink2URL: https://www.mouser.com/datasheet/2/418/NG_DS_9-1773463-9_A-1358566.pdf; ComponentLink2Description: Datasheet
R22 = CMP-03211-006592-1: as R1 on sheet Power; Ipc Land Pattern Name: RESC310155X55; Temperature Range Low: -55°C; Device Class L3: Chip SMD Resistors; ComponentLink2URL: https://www.te.com/commerce/DocumentDelivery/DDEController?Action=showdoc&DocId=Data+Sheet%7F1773204-3%7F1%7Fpdf%7FEnglish%7FENG_DS_1773204-3_1.pdf%7F4-2176347-694; Automotive: Yes; Temperature: -55°C to +155°C; Manufacturer Part Number: CRGCQ1206F1K0; Package: CRGCQ1206; Octopart: https://octopart.com/crgcq1206f1k0-te+connectivity-91018258; Device Class L1: Passive Components; Series: CRGCQ; Device Class L2: Resistors; RoHS: TRUE; Lead Free: Yes; ComponentLink2Description: Datasheet; Power Rating: 0.25W; Temperature Coefficient: ±100ppm/°C; Voltage Rating: 200V; Temperature Range High: +155°C; Height: 0.65mm; Category: Res; Resistance: 1KΩ; Composition: Thick Film; Ambient Temperature Range High: +70°C
SW1-SW3 = CMP-00287-56250562-1: EVQ-QJJ05Q Switch Tactile N.O. SPST Round Button PC Pins 0.005A 12VDC 0.8N Thru-Hole Radial T/R; Current Rating: 5mA; Life (Cycles): 1Mcycles; Switch Travel: 1mm; Illumination Type: Illuminated, Non-Illuminated; Operating Force: 800mN; Actuator Length: 1.5mm; Voltage Rating (DC): 12V; Contact Resistance: 200mΩ; Switch Function: Off-Mom; NexarPartId: 56250562; Contact Current Rating: 5mA; Radiation Hardening: No; Height: 5mm; Lead Free: Lead Free; Mechanical Life: 1Mcycles; REACH SVHC: No SVHC; RoHS: Compliant; Orientation: Straight; Case/Package: Axial; Contact Plating: Silver; Length: 8mm; Width: 8mm; Max Operating Temperature: 70°C; Max Voltage Rating (DC): 12V; Termination: PC Pin; Electrical Life: 1Mcycles; Throw Configuration: SPST; Mount: Through Hole; Packaging: Tape & Box (TB); Min Operating Temperature: -20°C
U5 = STM8S103F3P6: STM8 series Microcontroller IC 8-Bit 16MHz 8KB (8K x 8) FLASH 20-TSSOP; MF: STMicroelectronics; SnapEDA_Link: https://www.snapeda.com/parts/STM8S103F3P6/STMicroelectronics/view-part/?ref=snap; Package: TSSOP-20 STMicroelectronics; Value: *; MP: STM8S103F3P6; Check_prices: https://www.snapeda.com/parts/STM8S103F3P6/STMicroelectronics/view-part/?ref=eda

## Sheet NTC.SchDoc
size A4; SheetNumber: 7; SheetTotal: 7
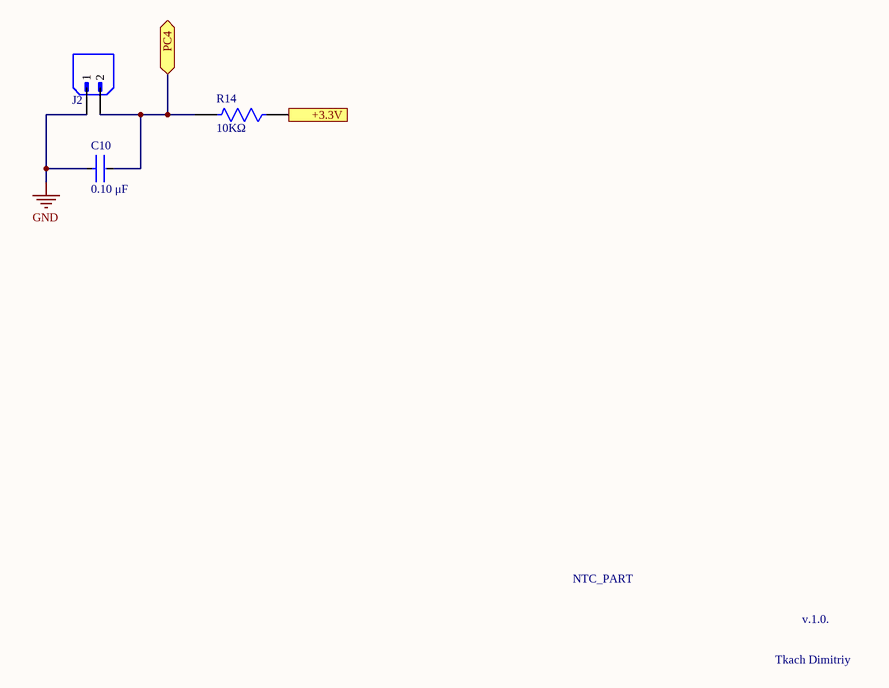
[diagram p6: NTC.SchDoc]

### Parts
C10  Capacitance: 0.10 μF  [CAPC3216X18M]  (hidden comment: C1206C104K5RACAUTO)
J2  B2B-XH-A  [JST_B2B-XH-A]  (value not drawn)
R14  Resistance: 10KΩ  [RESC3216X06M]  (hidden comment: CRGP1206F10K)

### Ports
+3.3V (in, see MainSheet[2B], Power[3B], STM8S103F3P6[3B], TM1637_Display[1B], UART[2B]), PC4 (bidir, see MainSheet[2B], STM8S103F3P6[2B])

### Nets
+3.3V: R14.1 ; port +3.3V
GND: C10.1 J2.1
NetC10_2: C10.2 J2.2 R14.2 ; port PC4

### Notes on the sheet
- NTC_PART
- v.1.0.
- Tkach Dimitriy

### Library data of the parts
C10 = CMP-03020-005759-1: as C8 on sheet Power; RoHS: TRUE; Lead Free: Yes; ComponentLink2Description: Datasheet; Automotive: Yes; Temperature Characteristic: X7R; Temperature Range Low: -55°C; Voltage Rating: 50 V; Device Class L1: Passive Components; Ipc Land Pattern Name: CAPC320160X78; Mouser Description: Multilayer Ceramic Capacitors MLCC - SMD/SMT 0.1uF 50volts 10% X7R AUTO; Octopart: https://octopart.com/c1206c104k5racauto-kemet-12595586; Device Class L3: Ceramic Capacitors; Manufacturer Part Number: C1206C104K5RACAUTO; Digikey Description: CAP CER 0.1UF 50V X7R 1206; Temperature Range High: +150°C; Temperature: -55°C to +150°C; Device Class L2: Capacitors; ComponentLink2URL: https://content.kemet.com/datasheets/KEM_C1007_X8R_ULTRA_150C_SMD.pdf; Package: C1206C-EB; Category: Cap; Height: 0.88mm
J2 = CMP-033-000000-1: MF: {'manufacturer': u'JST Sales America Inc.'}; Pin Count: 2; Source: B2B-XH-A.SchLib; Availability: Unavailable; Design Item ID: B2B-XH-A; Component Type: Standard; Value: *; Price: None; Package: None; MP: B2B-XH-A
R14 = CMP-03211-004788-1: as R21 on sheet Relay; Package: CRGP1206; Ambient Temperature Range High: +70°C; Device Class L2: Resistors; Lead Free: Yes; Automotive: No; Series: CRGP; Temperature Range High: +155°C; Ipc Land Pattern Name: RESC310155X55; Device Class L1: Passive Components; Octopart: https://octopart.com/crgp1206f10k-te+connectivity-91018843; Temperature: -55°C to +155°C; Category: Res; Height: 0.65mm; Temperature Range Low: -55°C; RoHS: TRUE; Manufacturer Part Number: CRGP1206F10K; Digikey Description: CRGP 1206 10K 1%; Device Class L3: Chip SMD Resistors; Composition: Thick Film; ComponentLink2URL: https://www.mouser.com/datasheet/2/418/NG_DS_9-1773463-9_A-1358566.pdf; ComponentLink2Description: Datasheet

## Nets that join several sheets
+3.3V: Power (C5.1 C6.1 U1.5), TM1637_Display (Q1.1 Q2.1 R2.1 R5.1), UART (Q3.1 Q5.1 R15.2 R19.2), STM8S103F3P6 (7 pins), NTC (R14.1)
+5V: Power (5 pins), Relay (D3.2 K1.A2 R18.1), TM1637_Display (C1.1 R3.1 R6.1 U2.16), UART (C2.1 R16.2 R20.2 U3.16)
GND: Power (16 pins), Relay (Q4.2 R21.1), TM1637_Display (C1.2 U2.1), UART (C2.2 C7.2 U3.1), STM8S103F3P6 (9 pins), NTC (C10.1 J2.1)
NetC10_2: STM8S103F3P6 (U5.14), NTC (C10.2 J2.2 R14.2)
NetQ1_2: TM1637_Display (Q1.2 R2.2), STM8S103F3P6 (U5.16)
NetQ2_2: TM1637_Display (Q2.2 R5.2), STM8S103F3P6 (U5.17)
NetQ3_2: UART (Q3.2 R15.1), STM8S103F3P6 (U5.2)
NetQ5_2: UART (Q5.2 R19.1), STM8S103F3P6 (U5.3)
NetR4_2: Power (R4.2), UART (U3.5)
NetR9_2: Power (R9.2), UART (U3.6)
NetR17_2: Relay (R17.2), STM8S103F3P6 (U5.13)